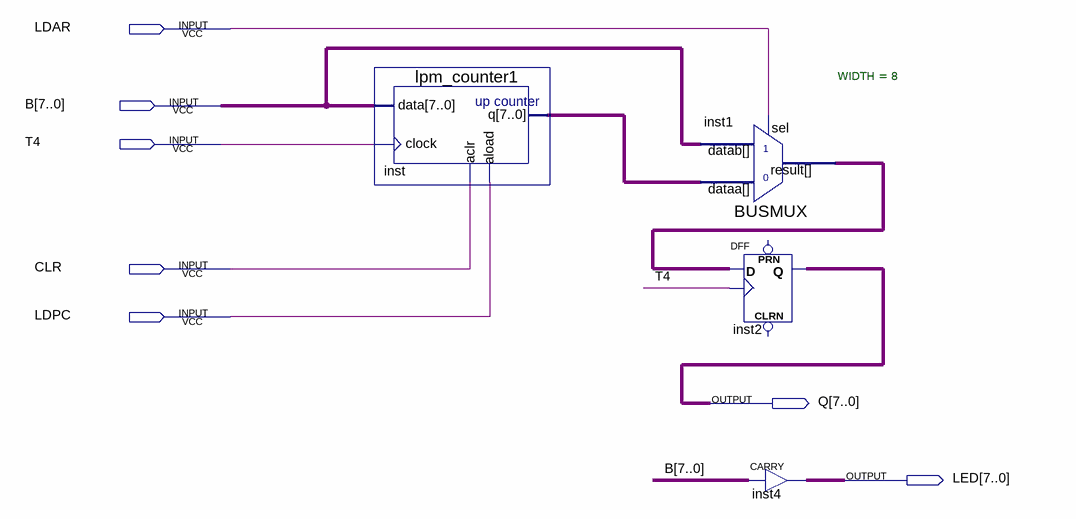
[diagram p0: schematic sheet]
// Quartus schematic task4.bdf as structural Verilog: 4 symbols, 7 pins
module task4 (
  input  LDAR,
  input  [7:0] B,
  input  T4,
  input  CLR,
  input  LDPC,
  output [7:0] Q,
  output [7:0] LED
);

  wire [7:0] inst1_result, inst_q;

  lpm_counter1 inst (.data(B), .clock(T4), .aclr(CLR), .aload(LDPC), .q(inst_q));
  BUSMUX #(.WIDTH(8)) inst1 (.datab(B), .sel(LDAR), .dataa(inst_q), .result(inst1_result));
  DFF inst2[7:0] (.CLK(T4), .D(inst1_result), .Q(Q));  // open: CLRN, PRN
  CARRY inst4[7:0] (.IN(B), .OUT(LED));
endmodule
